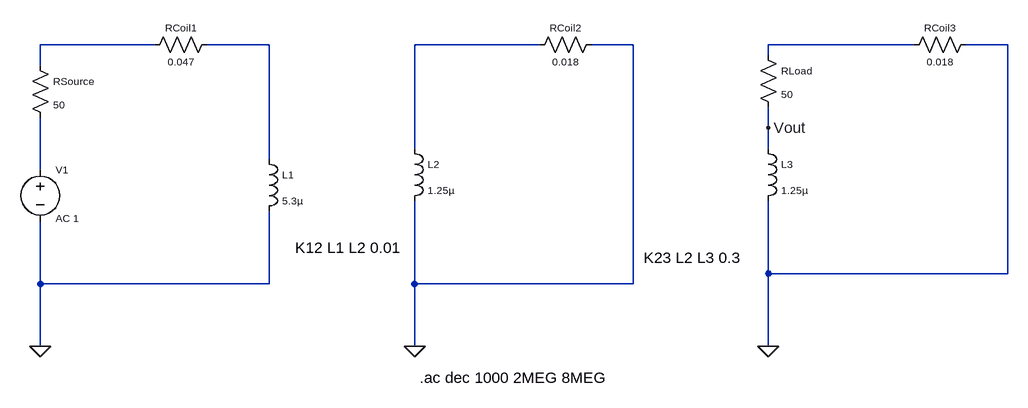
[diagram p0: schematic 3-coil_non-resonant.asc]
3-coil_non-resonant.asc, the LTspice schematic file:
Version 4.1
SHEET 1 1460 680
WIRE 144 -48 -32 -48
WIRE 320 -48 224 -48
WIRE 736 -48 544 -48
WIRE 880 -48 816 -48
WIRE 1312 -48 1088 -48
WIRE 1456 -48 1392 -48
WIRE 1088 -32 1088 -48
WIRE -32 -16 -32 -48
WIRE 1088 80 1088 48
WIRE 544 112 544 -48
WIRE 1088 112 1088 80
WIRE 320 128 320 -48
WIRE -32 144 -32 64
WIRE 1088 304 1088 192
WIRE 1456 304 1456 -48
WIRE 1456 304 1088 304
WIRE -32 320 -32 224
WIRE 320 320 320 208
WIRE 320 320 -32 320
WIRE 544 320 544 192
WIRE 880 320 880 -48
WIRE 880 320 544 320
WIRE -32 416 -32 320
WIRE 544 416 544 320
WIRE 1088 416 1088 304
FLAG -32 416 0
FLAG 544 416 0
FLAG 1088 416 0
FLAG 1088 80 Vout
SYMBOL res -48 -32 R0
WINDOW 0 36 40 Left 1
WINDOW 3 36 76 Left 1
SYMATTR InstName RSource
SYMATTR Value 50
SYMBOL res 1072 -48 R0
WINDOW 0 36 40 Left 1
WINDOW 3 36 76 Left 1
SYMATTR InstName RLoad
SYMATTR Value 50
SYMBOL ind 304 112 R0
WINDOW 0 36 40 Left 1
WINDOW 3 36 80 Left 1
SYMATTR InstName L1
SYMATTR Value 5.3µ
SYMATTR Type ind
SYMATTR SpiceLine Rser=1m
SYMBOL ind 528 96 R0
WINDOW 0 36 40 Left 1
WINDOW 3 36 80 Left 1
SYMATTR InstName L2
SYMATTR Value 1.25µ
SYMATTR Type ind
SYMATTR SpiceLine Rser=1m
SYMBOL ind 1072 96 R0
WINDOW 0 36 40 Left 1
WINDOW 3 36 80 Left 1
SYMATTR InstName L3
SYMATTR Value 1.25µ
SYMATTR Type ind
SYMATTR SpiceLine Rser=1m
SYMBOL voltage -32 128 R0
WINDOW 123 24 91 Left 1
WINDOW 39 0 0 Left 0
WINDOW 0 24 16 Left 1
SYMATTR Value2 AC 1
SYMATTR InstName V1
SYMATTR Value ""
SYMBOL res 240 -64 R90
WINDOW 0 0 56 VBottom 1
WINDOW 3 32 56 VTop 1
SYMATTR InstName RCoil1
SYMATTR Value 0.047
SYMBOL res 832 -64 R90
WINDOW 0 0 56 VBottom 1
WINDOW 3 32 56 VTop 1
SYMATTR InstName RCoil2
SYMATTR Value 0.018
SYMBOL res 1408 -64 R90
WINDOW 0 0 56 VBottom 1
WINDOW 3 32 56 VTop 1
SYMATTR InstName RCoil3
SYMATTR Value 0.018
TEXT 360 264 Left 2 !K12 L1 L2 0.01
TEXT 896 280 Left 2 !K23 L2 L3 0.3
TEXT 552 464 Left 2 !.ac dec 1000 2MEG 8MEG

The netlist it stands for:
* 3-coil_non-resonant.asc
RSource N001 N005 50
RLoad N004 Vout 50
L1 N002 0 5.3µ Rser=1m
L2 N003 0 1.25µ Rser=1m
L3 Vout 0 1.25µ Rser=1m
V1 N005 0 AC 1
RCoil1 N002 N001 0.047
RCoil2 0 N003 0.018
RCoil3 0 N004 0.018
K12 L1 L2 0.01
K23 L2 L3 0.3
.ac dec 1000 2MEG 8MEG
.backanno
.end